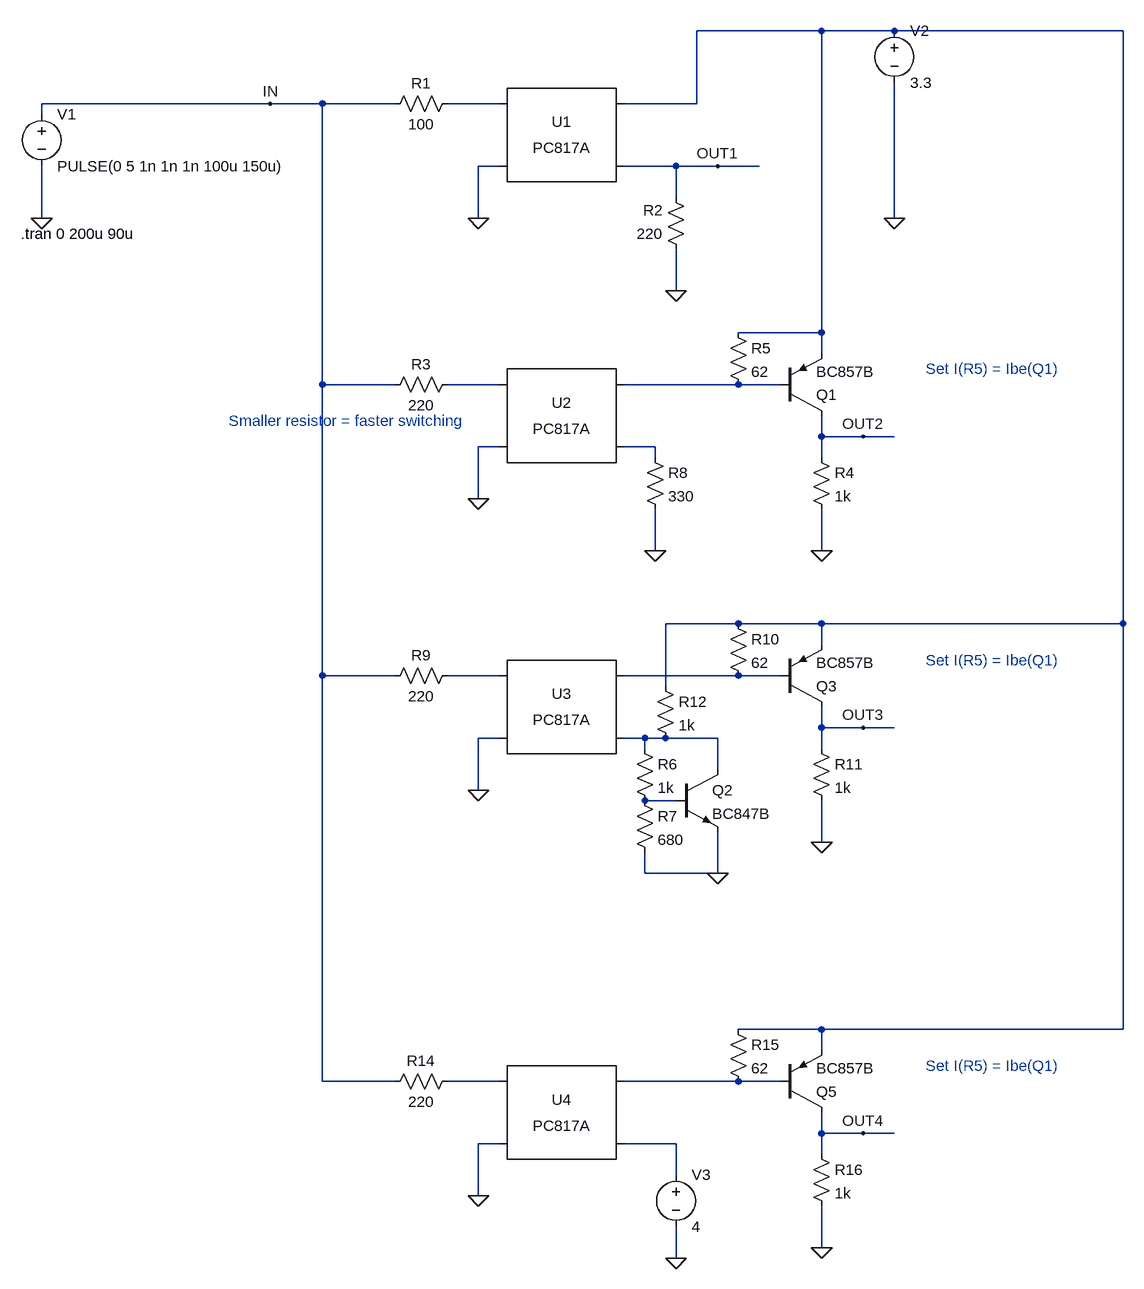
[diagram p0: schematic Opto_1.asc]
Opto_1.asc, the LTspice schematic file:
Version 4
SHEET 1 1700 1956
WIRE 592 16 400 16
WIRE 704 16 592 16
WIRE 1056 16 704 16
WIRE -256 128 -608 128
WIRE -176 128 -256 128
WIRE -64 128 -176 128
WIRE 96 128 16 128
WIRE 400 128 400 16
WIRE 400 128 288 128
WIRE -608 144 -608 128
WIRE 96 224 64 224
WIRE 368 224 288 224
WIRE 432 224 368 224
WIRE 496 224 432 224
WIRE 368 272 368 224
WIRE -608 304 -608 224
WIRE 64 304 64 224
WIRE 704 304 704 96
WIRE 368 416 368 352
WIRE 592 480 592 16
WIRE 592 480 464 480
WIRE 592 512 592 480
WIRE -176 560 -176 128
WIRE -64 560 -176 560
WIRE 96 560 16 560
WIRE 464 560 288 560
WIRE 528 560 464 560
WIRE 592 640 592 608
WIRE 656 640 592 640
WIRE 704 640 656 640
WIRE 96 656 64 656
WIRE 336 656 288 656
WIRE 336 672 336 656
WIRE 592 672 592 640
WIRE 64 736 64 656
WIRE 336 816 336 752
WIRE 592 816 592 752
WIRE 464 928 352 928
WIRE 592 928 464 928
WIRE 1056 928 1056 16
WIRE 1056 928 592 928
WIRE 592 960 592 928
WIRE -176 1008 -176 560
WIRE -64 1008 -176 1008
WIRE 96 1008 16 1008
WIRE 464 1008 288 1008
WIRE 528 1008 464 1008
WIRE 352 1024 352 928
WIRE 592 1088 592 1056
WIRE 656 1088 592 1088
WIRE 704 1088 656 1088
WIRE 96 1104 64 1104
WIRE 320 1104 288 1104
WIRE 352 1104 320 1104
WIRE 432 1104 352 1104
WIRE 320 1120 320 1104
WIRE 592 1120 592 1088
WIRE 432 1152 432 1104
WIRE 64 1184 64 1104
WIRE 368 1200 320 1200
WIRE 592 1264 592 1200
WIRE 320 1312 320 1280
WIRE 432 1312 432 1248
WIRE 432 1312 320 1312
WIRE 592 1552 464 1552
WIRE 1056 1552 1056 928
WIRE 1056 1552 592 1552
WIRE 592 1584 592 1552
WIRE -176 1632 -176 1008
WIRE -64 1632 -176 1632
WIRE 96 1632 16 1632
WIRE 464 1632 288 1632
WIRE 528 1632 464 1632
WIRE 592 1712 592 1680
WIRE 656 1712 592 1712
WIRE 704 1712 656 1712
WIRE 96 1728 64 1728
WIRE 368 1728 288 1728
WIRE 592 1744 592 1712
WIRE 368 1776 368 1728
WIRE 64 1808 64 1728
WIRE 592 1888 592 1824
WIRE 368 1904 368 1856
FLAG -608 304 0
FLAG 64 304 0
FLAG 368 416 0
FLAG 704 304 0
FLAG 64 736 0
FLAG 592 816 0
FLAG 432 224 OUT1
FLAG 656 640 OUT2
FLAG -256 128 IN
FLAG 432 1312 0
FLAG 336 816 0
FLAG 64 1184 0
FLAG 592 1264 0
FLAG 656 1088 OUT3
FLAG 64 1808 0
FLAG 592 1888 0
FLAG 656 1712 OUT4
FLAG 368 1904 0
SYMBOL Optos\\PC817A 192 176 R0
SYMATTR InstName U1
SYMBOL voltage -608 128 R0
WINDOW 123 0 0 Left 0
WINDOW 39 0 0 Left 0
SYMATTR InstName V1
SYMATTR Value PULSE(0 5 1n 1n 1n 100u 150u)
SYMBOL res 32 112 R90
WINDOW 0 0 56 VBottom 2
WINDOW 3 32 56 VTop 2
SYMATTR InstName R1
SYMATTR Value 100
SYMBOL res 384 368 R180
WINDOW 0 36 76 Left 2
WINDOW 3 36 40 Left 2
SYMATTR InstName R2
SYMATTR Value 220
SYMBOL voltage 704 0 R0
SYMATTR InstName V2
SYMATTR Value 3.3
SYMBOL Optos\\PC817A 192 608 R0
SYMATTR InstName U2
SYMBOL res 32 544 R90
WINDOW 0 0 56 VBottom 2
WINDOW 3 32 56 VTop 2
SYMATTR InstName R3
SYMATTR Value 220
SYMBOL pnp 528 608 M180
SYMATTR InstName Q1
SYMATTR Value BC857B
SYMBOL res 448 464 R0
SYMATTR InstName R5
SYMATTR Value 62
SYMBOL res 576 656 R0
SYMATTR InstName R4
SYMATTR Value 1k
SYMBOL npn 368 1152 R0
SYMATTR InstName Q2
SYMATTR Value BC847B
SYMBOL res 304 1104 R0
SYMATTR InstName R6
SYMATTR Value 1k
SYMBOL res 304 1184 R0
SYMATTR InstName R7
SYMATTR Value 680
SYMBOL res 320 656 R0
SYMATTR InstName R8
SYMATTR Value 330
SYMBOL Optos\\PC817A 192 1056 R0
SYMATTR InstName U3
SYMBOL res 32 992 R90
WINDOW 0 0 56 VBottom 2
WINDOW 3 32 56 VTop 2
SYMATTR InstName R9
SYMATTR Value 220
SYMBOL pnp 528 1056 M180
SYMATTR InstName Q3
SYMATTR Value BC857B
SYMBOL res 448 912 R0
SYMATTR InstName R10
SYMATTR Value 62
SYMBOL res 576 1104 R0
SYMATTR InstName R11
SYMATTR Value 1k
SYMBOL Optos\\PC817A 192 1680 R0
SYMATTR InstName U4
SYMBOL res 32 1616 R90
WINDOW 0 0 56 VBottom 2
WINDOW 3 32 56 VTop 2
SYMATTR InstName R14
SYMATTR Value 220
SYMBOL pnp 528 1680 M180
SYMATTR InstName Q5
SYMATTR Value BC857B
SYMBOL res 448 1536 R0
SYMATTR InstName R15
SYMATTR Value 62
SYMBOL res 576 1728 R0
SYMATTR InstName R16
SYMATTR Value 1k
SYMBOL voltage 368 1760 R0
SYMATTR InstName V3
SYMATTR Value 4
SYMBOL res 336 1008 R0
SYMATTR InstName R12
SYMATTR Value 1k
TEXT -640 328 Left 2 !.tran 0 200u 90u
TEXT 752 536 Left 2 ;Set I(R5) = Ibe(Q1)
TEXT -320 616 Left 2 ;Smaller resistor = faster switching
TEXT 752 984 Left 2 ;Set I(R5) = Ibe(Q1)
TEXT 752 1608 Left 2 ;Set I(R5) = Ibe(Q1)

The netlist it stands for:
* Opto_1.asc
XU1 N002 0 N001 OUT1 PC817 Igain=1m
V1 IN 0 PULSE(0 5 1n 1n 1n 100u 150u)
R1 N002 IN 100
R2 0 OUT1 220
V2 N001 0 3.3
XU2 N003 0 N004 N005 PC817 Igain=1m
R3 N003 IN 220
Q1 OUT2 N004 N001 0 BC857B
R5 N001 N004 62
R4 OUT2 0 1k
Q2 N008 N009 0 0 BC847B
R6 N008 N009 1k
R7 N009 0 680
R8 N005 0 330
XU3 N006 0 N007 N008 PC817 Igain=1m
R9 N006 IN 220
Q3 OUT3 N007 N001 0 BC857B
R10 N001 N007 62
R11 OUT3 0 1k
XU4 N010 0 N011 N012 PC817 Igain=1m
R14 N010 IN 220
Q5 OUT4 N011 N001 0 BC857B
R15 N001 N011 62
R16 OUT4 0 1k
V3 N012 0 4
R12 N001 N008 1k
.model NPN NPN
.model PNP PNP
.lib standard.bjt
.tran 0 200u 90u
* Set I(R5) = Ibe(Q1)
* Smaller resistor = faster switching
* Set I(R5) = Ibe(Q1)
* Set I(R5) = Ibe(Q1)
.lib PC817.sub
.backanno
.end